# Altium schematic sheet Shore Power.SchDoc
size A4
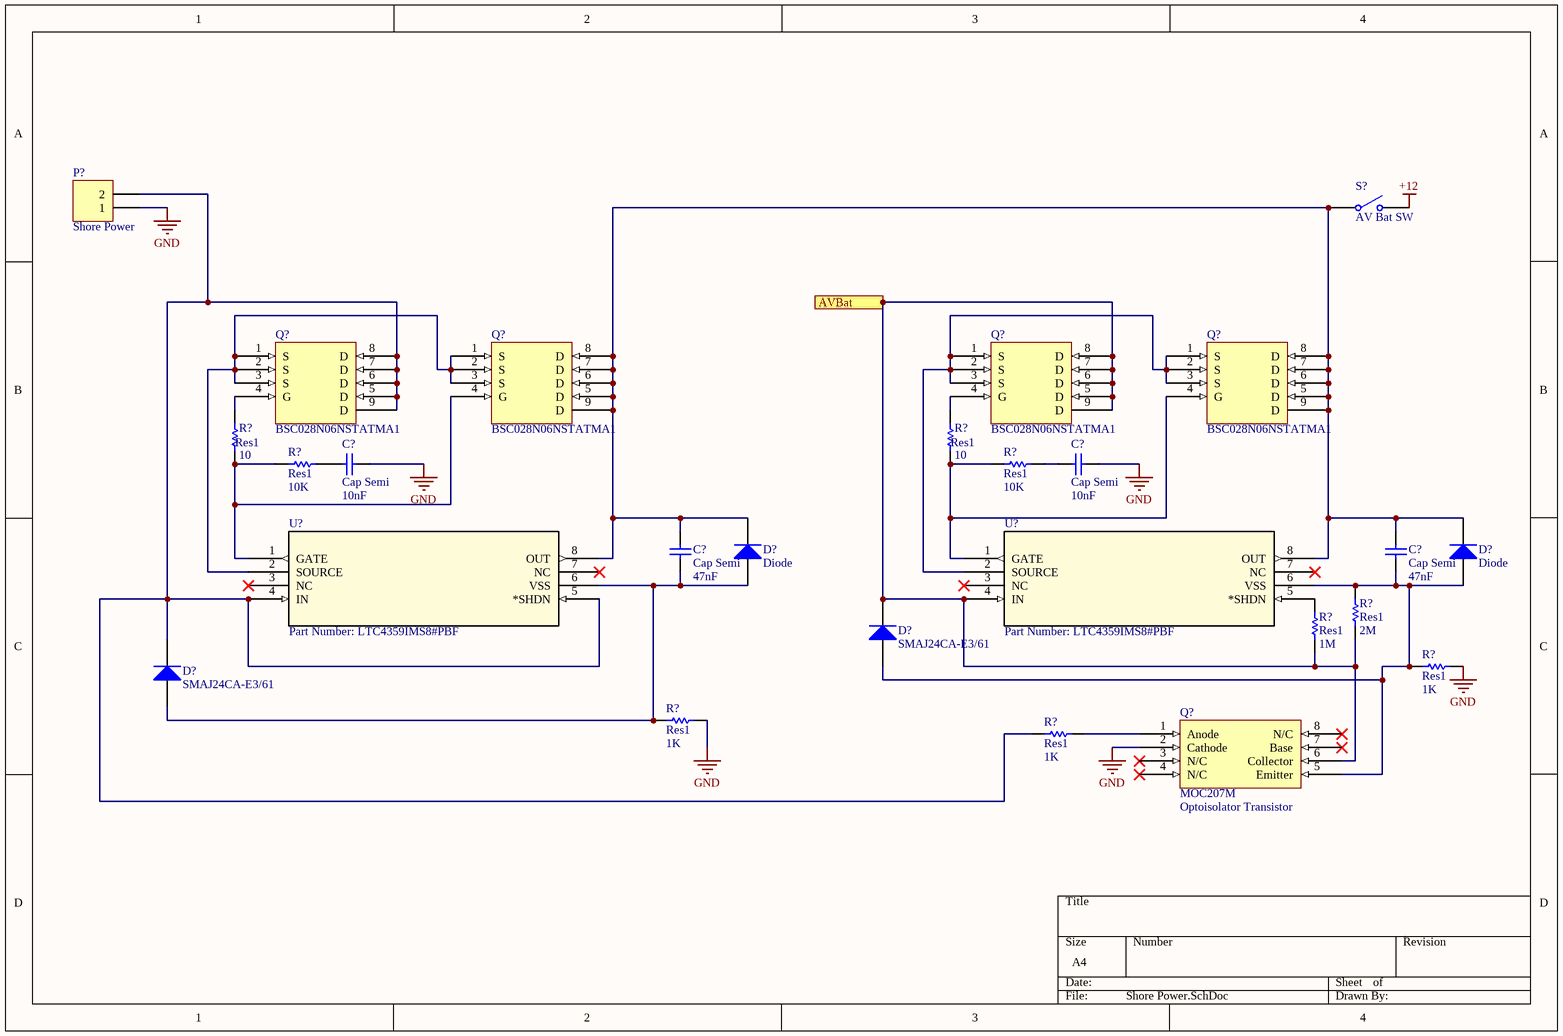
[diagram p0: Shore Power.SchDoc]

## Parts
(Parts that share a designator on the sheet are numbered #1, #2 ... from top to bottom, then left to right.)
C?#1  Cap Semi  value 10nF  [C1206]
C?#2  Cap Semi  value 10nF  [C1206]
C?#3  Cap Semi  value 47nF  [C1206]
C?#4  Cap Semi  value 47nF  [C1206]
D?#1  Diode  [DIOM4427X27N]
D?#2  Diode  [DIOM4427X27N]
D?#3  SMAJ24CA-E3/61  [DIODE_DO-214AC]
D?#4  SMAJ24CA-E3/61  [DIODE_DO-214AC]
P?  Shore Power  [M80-5000000M5-02-333-00-000]
Q?#1  BSC028N06NSTATMA1  [FDMS86101A]
Q?#2  BSC028N06NSTATMA1  [FDMS86101A]
Q?#3  BSC028N06NSTATMA1  [FDMS86101A]
Q?#4  BSC028N06NSTATMA1  [FDMS86101A]
Q?#5  MOC207M  [SOIC127P590X363-8N]
R?#1  Res1  value 10  [6-0805_L]
R?#2  Res1  value 10K  [6-0805_L]
R?#3  Res1  value 10  [6-0805_L]
R?#4  Res1  value 10K  [6-0805_L]
R?#5  Res1  value 1M  [J1-0603]
R?#6  Res1  value 2M  [J1-0603]
R?#7  Res1  value 1K  [STA_RMCF2512]
R?#8  Res1  value 1K  [STA_RMCF2512]
R?#9  Res1  value 1K  [STA_RMCF2512]
S?  AV Bat SW  [M80-5000000M5-02-333-00-000]
U?#1  Part Number: LTC4359IMS8#PBF  [MSOP-8_MS]
U?#2  Part Number: LTC4359IMS8#PBF  [MSOP-8_MS]

## Ports
AVBat

## Nets
+12: S?.2(NO)
GND: C?#1.1 C?#2.1 P?.1 Q?#5.2(Cathode) R?#7.1 R?#8.1
AVBat: D?#3.2(K) Q?#3.5(D) Q?#3.6(D) Q?#3.7(D) Q?#3.8(D) Q?#3.9(D) Q?#5.6(Collector) R?#5.2 R?#6.1 U?#2.4(IN) ; port AVBat
NetC?#1_2: C?#1.2 R?#2.2
NetC?#2_2: C?#2.2 R?#4.2
NetC?#3_1: C?#3.1 C?#4.1 D?#1.2(K) D?#2.2(K) Q?#2.5(D) Q?#2.6(D) Q?#2.7(D) Q?#2.8(D) Q?#2.9(D) Q?#4.5(D) Q?#4.6(D) Q?#4.7(D) Q?#4.8(D) Q?#4.9(D) S?.1(COMMON) U?#1.8(OUT) U?#2.8(OUT)
NetC?#3_2: C?#3.2 D?#1.1(A) D?#4.1(A) R?#8.2 U?#1.6(VSS)
NetC?#4_2: C?#4.2 D?#2.1(A) D?#3.1(A) Q?#5.5(Emitter) R?#6.2 R?#7.2 U?#2.6(VSS)
NetD?#4_2: D?#4.2(K) P?.2 Q?#1.5(D) Q?#1.6(D) Q?#1.7(D) Q?#1.8(D) Q?#1.9(D) R?#9.2 U?#1.4(IN) U?#1.5(*SHDN)
NetQ?#1_1: Q?#1.1(S) Q?#1.2(S) Q?#1.3(S) Q?#2.1(S) Q?#2.2(S) Q?#2.3(S) U?#1.2(SOURCE)
NetQ?#1_4: Q?#1.4(G) R?#1.2
NetQ?#2_4: Q?#2.4(G) R?#1.1 R?#2.1 U?#1.1(GATE)
NetQ?#3_1: Q?#3.1(S) Q?#3.2(S) Q?#3.3(S) Q?#4.1(S) Q?#4.2(S) Q?#4.3(S) U?#2.2(SOURCE)
NetQ?#3_4: Q?#3.4(G) R?#3.2
NetQ?#4_4: Q?#4.4(G) R?#3.1 R?#4.1 U?#2.1(GATE)
NetQ?#5_1: Q?#5.1(Anode) R?#9.1
NetR?#5_1: R?#5.1 U?#2.5(*SHDN)

Not connected (* = marked no-connect by the designer): Q?#5 3(N/C)* 4(N/C)* 7(Base)* 8(N/C)*; U?#1 3(NC)* 7(NC)*; U?#2 3(NC)* 7(NC)*

## Library data of the parts
C?#1-C?#4 = Cap Semi: Capacitor (Semiconductor SIM Model); Published: 8-Jun-2000; LatestRevisionDate: 29-May-2009; LatestRevisionNote: IPC-7351 Footprint Added.; PackageReference: C1206; Publisher: Altium Limited; PackageDescription: Chip Capacitor
  C?#1 C?#2: Supplier Part Number: 1276-2735-1-ND
  C?#3 C?#4: Supplier Part Number: 311-4451-1-ND
D?#1 D?#2 = Diode: Default Diode; pin to pad: 1>2 2>1; Published: 8-Jun-2000; LatestRevisionDate: 17-Jul-2002; LatestRevisionNote: Re-released for DXP Platform.; PackageVersion: Sep-1996; PackageReference: SMC; Publisher: Altium Limited; PackageDescription: DO-214-AB/SMC; 2 C-Bend Leads; Body 7.9 x 5.9 mm, inc. leads (LxW); Code_JEDEC: DO-214-AB
D?#3 D?#4 = Diode: Default Diode; SPN: SMAJ24CA-E3/61GICT-ND; Published: 8-Jun-2000; LatestRevisionDate: 17-Jul-2002; LatestRevisionNote: Re-released for DXP Platform.; PackageVersion: Sep-1996; PackageReference: SMC; Publisher: Altium Limited; PackageDescription: DO-214-AB/SMC; 2 C-Bend Leads; Body 7.9 x 5.9 mm, inc. leads (LxW); Code_JEDEC: DO-214-AB
P? = Header 2: Header, 2-Pin; LatestRevisionDate: 17-Jul-2002; LatestRevisionNote: Re-released for DXP Platform.; Publisher: Altium Limited
Q?#1-Q?#4 = FDMS86101A: MOSFET N-CH 100V 13A POWER56; SPN: BSC028N06NSTATMA1CT-ND
Q?#5 = MOC207M: Optoisolator Transistor; SPN: MOC207M-ND; Desc: Optoisolator Transistor
R?#1 R?#3 = Res1: Resistor; SPN: RHM10.0AECT-ND; Published: 8-Jun-2000; LatestRevisionDate: 17-Jul-2002; LatestRevisionNote: Re-released for DXP Platform.; PackageReference: AXIAL-0.3; Publisher: Altium Limited; PackageDescription: Axial Device, Thru-Hole; 2 Leads; 0.3 in Pin Spacing
R?#2 R?#4 = Res1: Resistor; SPN: RNCP0805FTD10K0CT-ND; Published: 8-Jun-2000; LatestRevisionDate: 17-Jul-2002; LatestRevisionNote: Re-released for DXP Platform.; PackageReference: AXIAL-0.3; Publisher: Altium Limited; PackageDescription: Axial Device, Thru-Hole; 2 Leads; 0.3 in Pin Spacing
R?#5 = Res1: Resistor; SPN: RHM1MDCT-ND; Published: 8-Jun-2000; LatestRevisionDate: 17-Jul-2002; LatestRevisionNote: Re-released for DXP Platform.; PackageReference: AXIAL-0.3; Publisher: Altium Limited; PackageDescription: Axial Device, Thru-Hole; 2 Leads; 0.3 in Pin Spacing
R?#6 = Res1: Resistor; SPN: RHM2MDCT-ND; Published: 8-Jun-2000; LatestRevisionDate: 17-Jul-2002; LatestRevisionNote: Re-released for DXP Platform.; PackageReference: AXIAL-0.3; Publisher: Altium Limited; PackageDescription: Axial Device, Thru-Hole; 2 Leads; 0.3 in Pin Spacing
R?#7-R?#9 = Res1: Resistor; SPN: RMCF2512JT1K00CT-ND; Published: 8-Jun-2000; LatestRevisionDate: 17-Jul-2002; LatestRevisionNote: Re-released for DXP Platform.; PackageReference: AXIAL-0.3; Publisher: Altium Limited; PackageDescription: Axial Device, Thru-Hole; 2 Leads; 0.3 in Pin Spacing
S? = SW-SPST: Single-Pole, Single-Throw Switch; Published: 24-Mar-1999; LatestRevisionDate: 17-Jul-2002; LatestRevisionNote: Re-released for DXP Platform.; PackageReference: SPST-2; Publisher: Altium Limited; PackageDescription: Switch; 2 Leads
U?#1 U?#2 = LTC4359IMS8#PBF: No Description Available; Vendor: Linear Technology; Built_By: EMA_UL_Team; Manufacturer_Part_Number: LTC4359IMS8#PBF; Copyright: Copyright (C) 2018 Accelerated Designs. All rights reserved; RefDes: RefDes; Type: DEV; Value: Value